# Altium schematic sheet 通信驱动电路.SchDoc
size A4
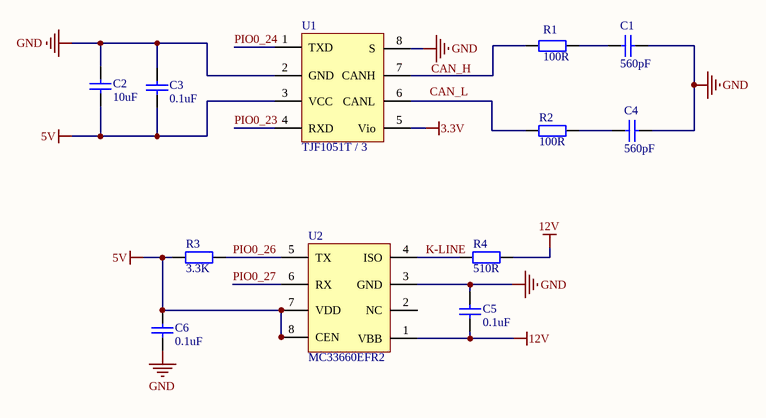
[diagram p0: 通信驱动电路.SchDoc]

## Parts
C1  560pF  [0603]
C2  10uF  [0603]
C3  0.1uF  [0603]
C4  560pF  [0603]
C5  0.1uF  [0603]
C6  0.1uF  [0603]
R1  100R  [0603]
R2  100R  [0603]
R3  3.3K  [0603]
R4  510R  [0603]
U1  TJF1051T / 3  [TJF1051]
U2  MC33660EFR2  [SOP-8]

## Nets
3.3V: U1.5(Vio)
5V: C2.1 C3.1 C6.2 R3.2 U1.3(VCC) U2.7(VDD) U2.8(CEN)
12V: C5.1 R4.1 U2.1(VBB)
GND: C1.1 C2.2 C3.2 C4.1 C5.2 C6.1 U1.2(GND) U1.8(S) U2.3(GND)
K-LINE: R4.2 U2.4(ISO)
PIO0_23: U1.4(RXD)
PIO0_24: U1.1(TXD)
PIO0_26: R3.1 U2.5(TX)
PIO0_27: U2.6(RX)
NetC1_2: C1.2 R1.1
NetC4_2: C4.2 R2.1
NetR1_2: R1.2 U1.7(CANH)
NetR2_2: R2.2 U1.6(CANL)

Not connected (* = marked no-connect by the designer): U2 2(NC)

## Notes on the sheet
- Labels drawn without touching a wire or pin: CAN_H, CAN_L

## Library data of the parts
C1-C6 = Cap1: ceramic
R1-R4 = Res